# EAGLE design COUNT-1-BCD (EAGLE 7.2.0)
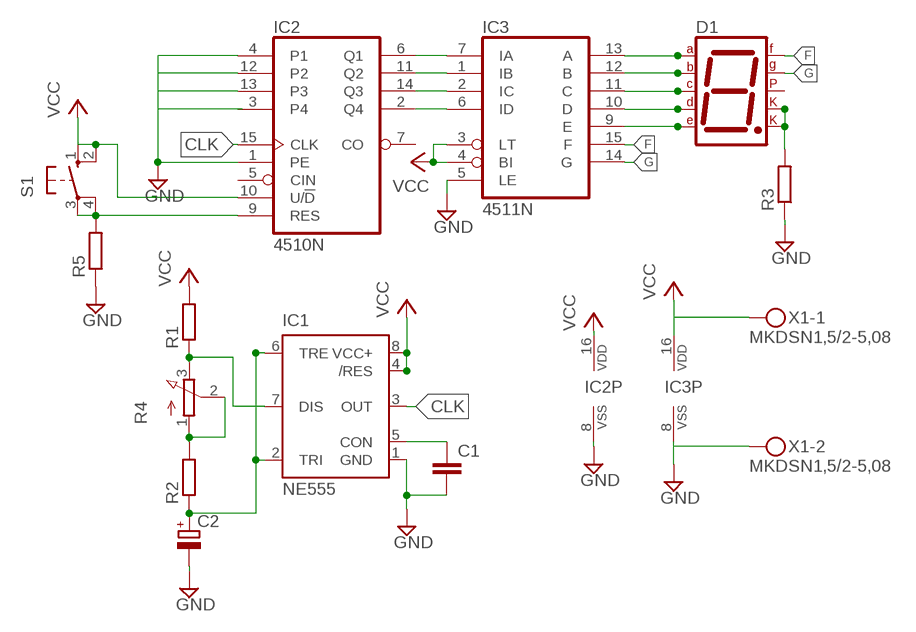
[diagram p0: schematic, sheet 1]

## Parts
C1  C2.5/2  [C2.5-2]
C2  CPOL-EUE2,5-6E  [E2,5-6E]
D1  7SEG-CK  [7SEG-13]
IC1  NE555  [DIL-08]
IC2  4510N  [DIL16]
IC3  4511N  [DIL16]
R1  R-EU_0204/7  [0204/7]
R2  R-EU_0204/7  [0204/7]
R3  R-EU_0204/7  [0204/7]
R4  3RP/1610N  [3RP/1610N]
R5  R-EU_0204/7  [0204/7]
S1  10-XX  [B3F-10XX]
X1  MKDSN1,5/2-5,08  [MKDSN1,5/2-5,08]

## Nets
CLK: IC1.3(OUT) IC2.15(CLK)
F: D1.9(F) IC3.15(F)
G: D1.10(G) IC3.14(G)
GND: C1.2 C2.- IC1.1(GND) IC2.1(PE) IC2.4(P1) IC2.8(VSS) IC2.12(P2) IC2.13(P3) IC3.5(LE) IC3.8(VSS) R3.1 R5.1 X1.2
N$1: D1.3(CK1) D1.8(CK2) R3.2
N$2: D1.7(A) IC3.13(A)
N$3: D1.6(B) IC3.12(B)
N$4: D1.4(C) IC3.11(C)
N$5: D1.2(D) IC3.10(D)
N$6: D1.1(E) IC3.9(E)
N$7: C1.1 IC1.5(CON)
N$8: C2.+ IC1.2(TRI) IC1.6(TRE) R2.1
N$9: IC2.11(Q2) IC3.1(IB)
N$10: IC2.14(Q3) IC3.2(IC)
N$11: IC2.9(RES) R5.2 S1.3(P) S1.4(P1)
N$12: IC2.2(Q4) IC3.6(ID)
N$13: IC2.6(Q1) IC3.7(IA)
N$15: IC1.7(DIS) R1.1 R4.3(E)
N$16: R2.2 R4.1(A) R4.2(S)
VCC: IC1.4(/RES) IC1.8(VCC+) IC2.10(U/!D) IC2.16(VDD) IC3.3(LT) IC3.4(BI) IC3.16(VDD) R1.2 S1.1(S) S1.2(S1) X1.1
Unconnected: D1.5(DP) IC2.3(P4) IC2.5(CIN) IC2.7(CO)

## Library data of the parts
C1 = capacitor-wima:C: CAPACITOR naming: grid - package width
C2 = rcl:CPOL-EU: POLARIZED CAPACITOR, European symbol
D1 = special:7SEG-CK: 7-segment DISPLAY single cathode, 13 mm
IC1 = st-microelectronics:NE555: General purpose bipolar Timer; MF: Arrow Electronics; MPN: NE555N; OC_FARNELL: 1467742; OC_NEWARK: 89K1486
IC2 = 45xx:4510: BCD up down COUNTER
IC3 = 45xx:4511: BCD to 7-segment LATCH/DECODER/DRIVER
R1-R3 R5 = rcl:R-EU_: RESISTOR, European symbol
R4 = pot:3RP/1610N: 16mm Potentiometer one level Source: http://www.alphapotentiometers.net/html/16mm_pot_2.html
S1 = switch-omron:10-XX: OMRON SWITCH; MPN: B3F-1000; OC_FARNELL: 176432; OC_NEWARK: 36M3542
X1 = con-phoenix-508:MKDSN1,5/2-5,08: MKDSN 1,5/ 2-5,08 Printklemme Nennstrom: 13,5 A Nennspannung: 250 V Rastermaß: 5,08 mm Polzahl: 2 Anschlussart: Schraubanschluss Montage: Löten Anschlussrichtung Leiter/Platine: 0 ° Artikelnummer: 1729128 Source: http://eshop.phoenixcontact.com .. 1729128.pdf

## Board
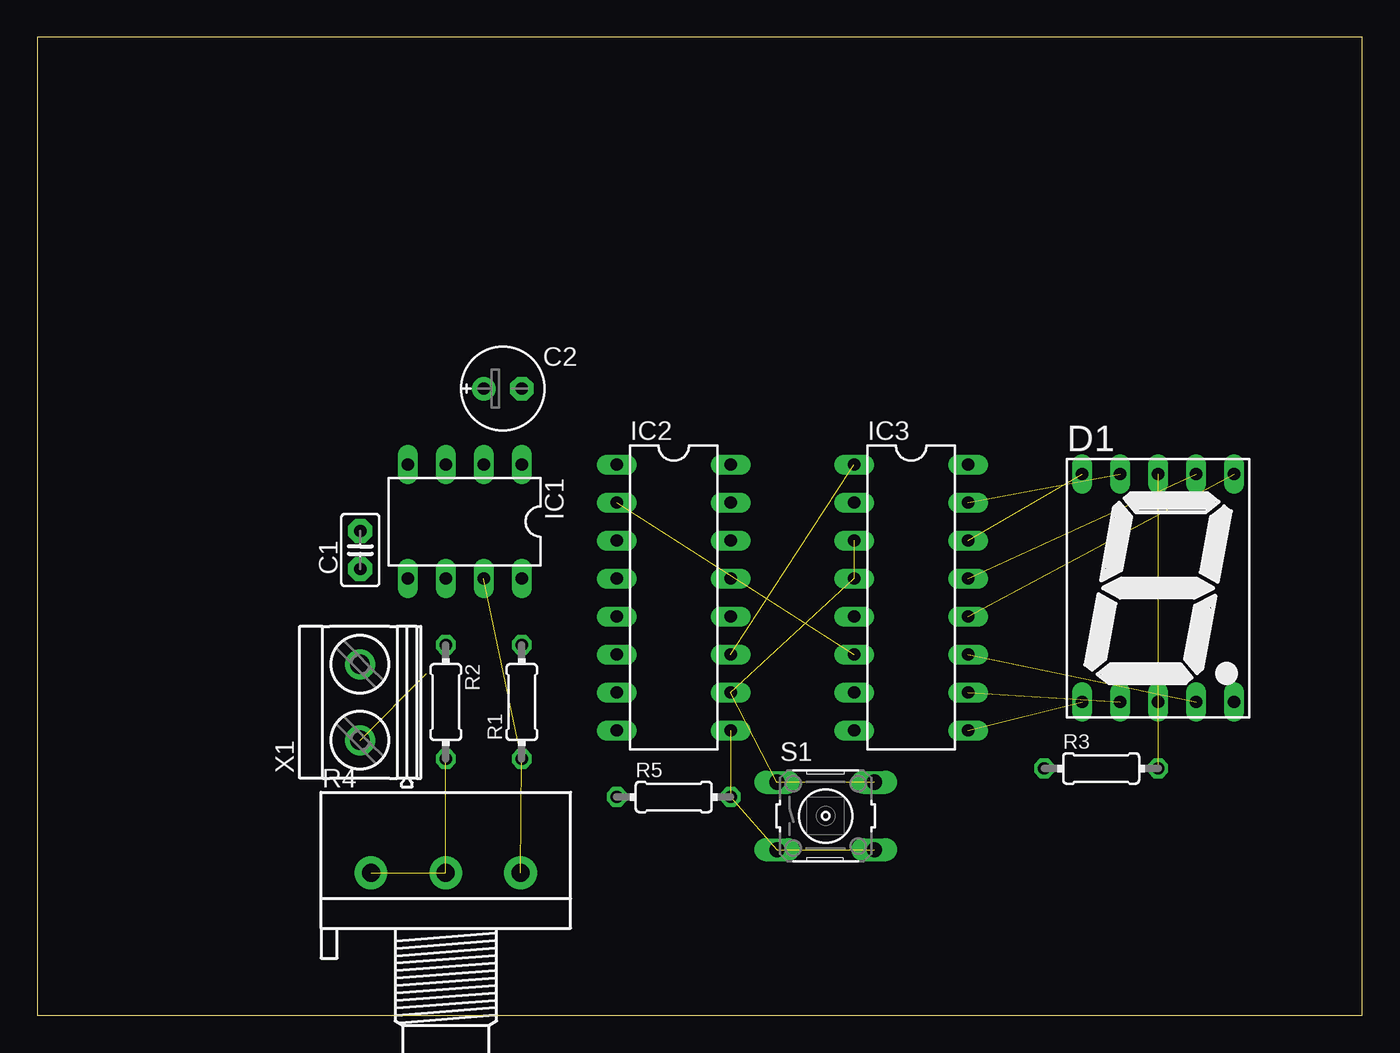
[diagram p1: board, top side]
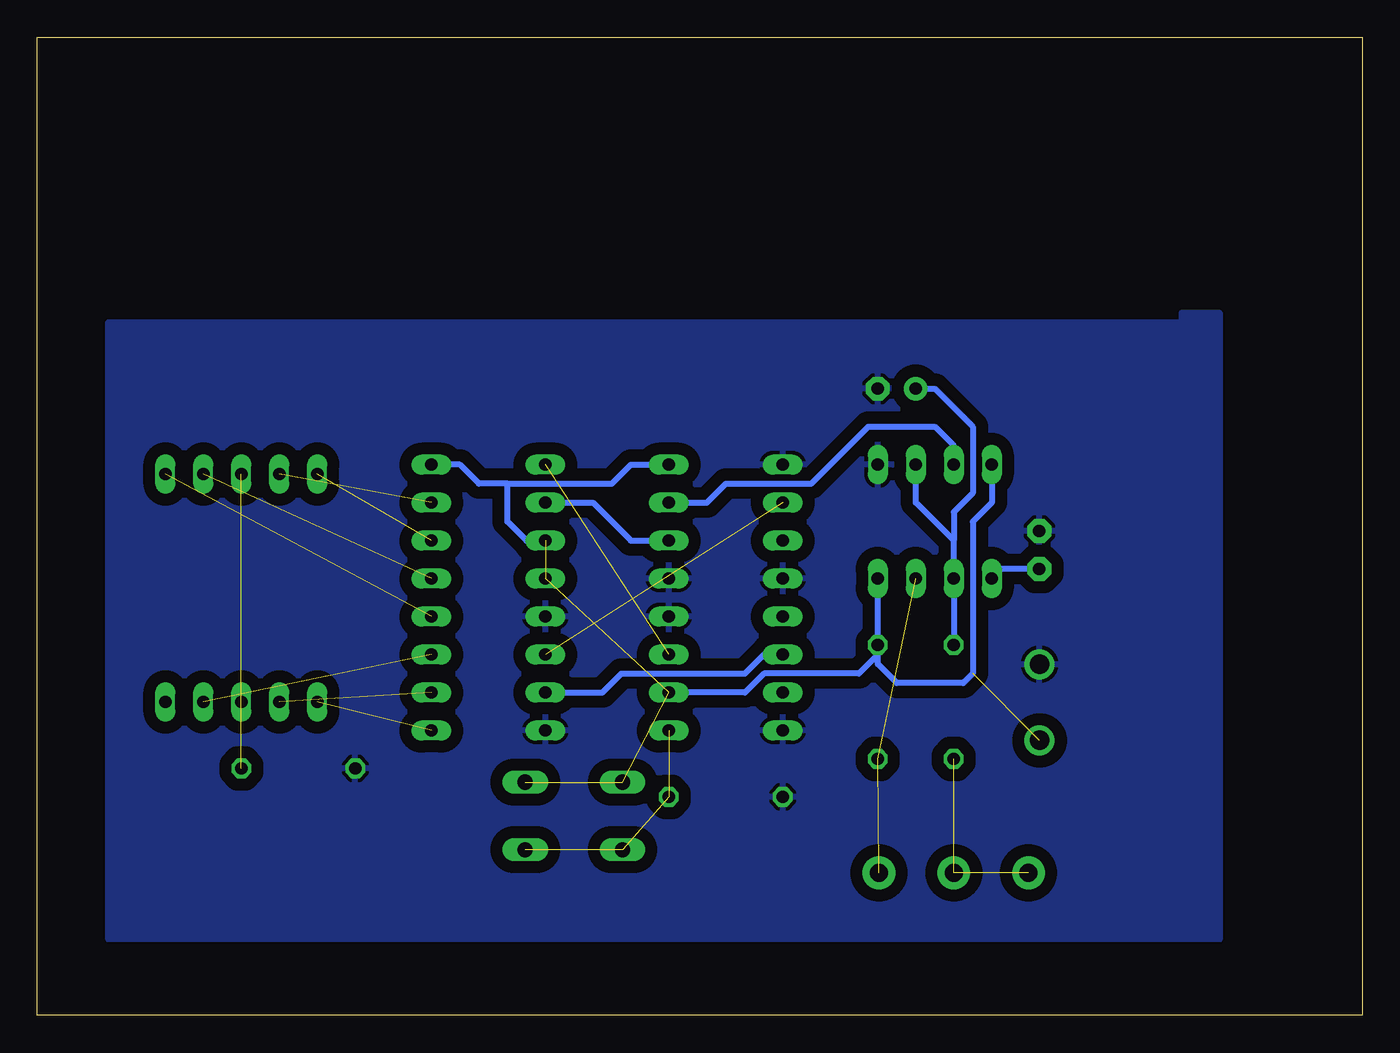
[diagram p2: board, bottom side, seen from below]

Size 88.57 x 65.39 mm. Coordinates in mm from the lower left corner, seen from the top.
Outline: 0,0 88.57,0 88.57,65.39 0,65.39 0,0
Copper layers (1*16): Top 0.035mm / dielectric 1.5mm / Bottom 0.035mm
Design rules "default": minimum track width 10mil, minimum drill 24mil, track to track 8mil, track to pad 8mil, pad to pad 8mil, via to via 8mil, smd to smd 8mil, copper to edge 40mil, drill to drill 8mil, minimum pad ring 10mil, minimum via ring 8mil, stop-mask expansion 4mil, vias tented up to drill 0mil, thermal gap 10mil

### Footprints (pad centres in the part's own frame; a part is rotated, then mirrored left to right if it is on the bottom)
C2.5-2 = drill 0.813 pad 1.6 octagon: 1 -1.27,0; 2 1.27,0
E2,5-6E = drill 0.813 pad 1.575: + -1.27,0 | drill 0.813 pad 1.575 octagon: - 1.27,0
7SEG-13 = drill 0.813 long: 1 -5.08,-7.62; 2 -2.54,-7.62; 3 0,-7.62; 4 2.54,-7.62; 5 5.08,-7.62; 6 5.08,7.62; 7 2.54,7.62; 8 0,7.62; 9 -2.54,7.62; 10 -5.08,7.62
DIL-08 = drill 0.813 long: 1 -3.81,-3.81; 2 -1.27,-3.81; 3 1.27,-3.81; 4 3.81,-3.81; 5 3.81,3.81; 6 1.27,3.81; 7 -1.27,3.81; 8 -3.81,3.81
DIL16 = drill 0.813 long: 1 -8.89,-3.81; 2 -6.35,-3.81; 3 -3.81,-3.81; 4 -1.27,-3.81; 5 1.27,-3.81; 6 3.81,-3.81; 7 6.35,-3.81; 8 8.89,-3.81; 9 8.89,3.81; 10 6.35,3.81; 11 3.81,3.81; 12 1.27,3.81; 13 -1.27,3.81; 14 -3.81,3.81; 15 -6.35,3.81; 16 -8.89,3.81
0204/7 = drill 0.813 octagon: 1 -3.81,0; 2 3.81,0
3RP/1610N = drill 1.2 pad 2.184: 1 -5,0; 2 0,0; 3 5,0
B3F-10XX = drill 1.016 long: 1 -3.251,2.261; 2 3.251,2.261; 3 -3.251,-2.261; 4 3.251,-2.261
MKDSN1,5/2-5,08 = drill 1.3 pad 2: 1 -2.561,0.025; 2 2.519,0.025

### Placement (x,y rotation side)
C1  21.59,31.11 90 top
C2  31.11,41.91 0 top
D1  74.93,28.57 0 top
IC1  28.57,33.02 180 top
IC2  42.55,27.94 270 top
IC3  58.42,27.94 270 top
R1  32.38,20.95 90 top
R2  27.3,20.95 270 top
R3  71.12,16.51 0 top
R4  27.3,9.53 0 top
R5  42.55,14.61 0 top
S1  52.7,13.34 0 top
X1  21.59,20.95 90 top

### Tracks (layer width: path | path; a pad name or v marks a point on that pad's centre or on a via)
CLK
  Bottom 0.406: IC2.15 43.81,34.29 42.55,35.56 36.83,35.56 33.02,39.37 28.57,39.37 27.3,38.1 IC1.3
F  (1 unrouted)
G  (1 unrouted)
GND
  pour Bottom (isolate 0.813): 12.06,5.08 83.82,5.08 83.82,46.35 12.06,46.35 12.06,46.99 9.53,46.99 9.53,5.08
N$1  (2 unrouted)
N$2  (1 unrouted)
N$3  (1 unrouted)
N$4  (1 unrouted)
N$5  (1 unrouted)
N$6  (1 unrouted)
N$7
  Bottom 0.406: C1.1 24.13,29.84 IC1.5
N$8
  Bottom 0.406: 27.3,31.75 IC1.6 R2.1 | 27.3,31.75 29.84,34.29 IC1.2 | C2.+ 28.57,41.91 26.04,39.37 26.04,34.92 27.3,33.66 27.3,31.75
N$9  (1 unrouted)
N$10
  Bottom 0.406: IC3.2 51.44,34.29 48.9,31.75 IC2.14
N$11  (3 unrouted)
N$12  (1 unrouted)
N$13
  Bottom 0.406: IC3.7 50.8,21.59 49.53,22.86 41.27,22.86 40.01,24.13 IC2.6
N$15  (2 unrouted)
N$16  (2 unrouted)
VCC  (5 unrouted)
  Bottom 0.406: 32.38,24.13 R1.2 IC1.8 | 32.38,24.13 33.66,22.86 40.01,22.86 41.27,21.59 IC2.10 | IC1.4 24.77,34.29 26.04,33.02 26.04,22.86 26.67,22.23 31.11,22.23 32.38,23.5 32.38,24.13 | IC3.3 55.88,31.75 57.15,33.02 57.15,35.56 | 57.15,35.56 50.16,35.56 48.9,36.83 IC2.16 | 57.15,35.56 59.05,35.56 60.33,36.83 IC3.16